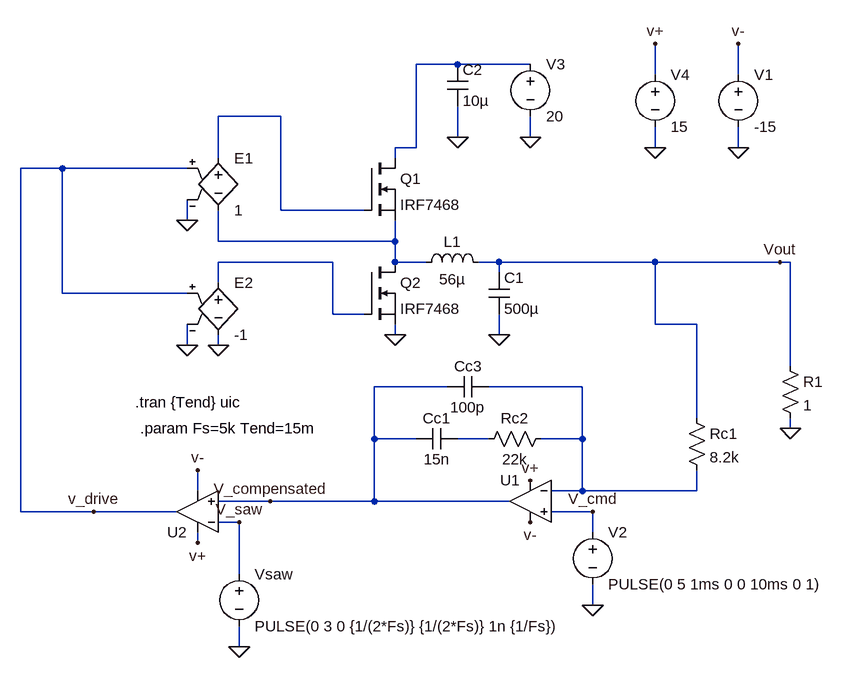
[diagram p0: schematic buck_combined_Type_2.asc]
buck_combined_Type_2.asc, the LTspice schematic file:
Version 4
SHEET 1 1764 1252
WIRE 432 -48 368 -48
WIRE 544 -48 432 -48
WIRE 736 -32 736 -80
WIRE 864 -32 864 -80
WIRE 160 32 64 32
WIRE 432 64 432 16
WIRE 544 64 544 32
WIRE 368 80 368 -48
WIRE 368 80 336 80
WIRE 736 80 736 48
WIRE 864 80 864 48
WIRE 64 96 64 32
WIRE 336 96 336 80
WIRE -176 112 -240 112
WIRE 16 112 -176 112
WIRE 160 176 160 32
WIRE 288 176 160 176
WIRE 16 192 16 160
WIRE 64 224 64 176
WIRE 336 224 336 192
WIRE 336 224 64 224
WIRE 240 256 64 256
WIRE 336 256 336 224
WIRE 384 256 336 256
WIRE 496 256 464 256
WIRE 736 256 496 256
WIRE 928 256 736 256
WIRE 944 256 928 256
WIRE 496 272 496 256
WIRE 64 288 64 256
WIRE -176 304 -176 112
WIRE 16 304 -176 304
WIRE 240 336 240 256
WIRE 288 336 240 336
WIRE 736 352 736 256
WIRE 800 352 736 352
WIRE 336 368 336 352
WIRE 496 368 496 336
WIRE 16 384 16 352
WIRE 64 384 64 368
WIRE 944 416 944 256
WIRE 416 448 304 448
WIRE 624 448 480 448
WIRE 800 496 800 352
WIRE 944 512 944 496
WIRE 304 528 304 448
WIRE 368 528 304 528
WIRE 480 528 432 528
WIRE 624 528 624 448
WIRE 624 528 560 528
WIRE 32 608 32 576
WIRE 624 608 624 528
WIRE 624 608 576 608
WIRE 800 608 800 576
WIRE 800 608 624 608
WIRE 144 624 64 624
WIRE 304 624 304 528
WIRE 304 624 144 624
WIRE 512 624 304 624
WIRE -240 640 -240 112
WIRE -128 640 -240 640
WIRE 0 640 -128 640
WIRE 640 640 576 640
WIRE 96 656 64 656
WIRE 640 672 640 640
WIRE 32 688 32 672
WIRE 96 736 96 656
WIRE 640 784 640 752
WIRE 96 848 96 816
FLAG 336 368 0
FLAG 544 64 0
FLAG 496 368 0
FLAG 944 512 0
FLAG 640 784 0
FLAG 96 848 0
FLAG 544 592 v+
FLAG 928 256 Vout
FLAG 144 624 V_compensated
FLAG 96 656 V_saw
FLAG 16 192 0
FLAG 16 384 0
FLAG 64 384 0
FLAG 432 64 0
FLAG 736 80 0
FLAG 864 80 0
FLAG 736 -80 v+
FLAG 864 -80 v-
FLAG 544 656 v-
FLAG 32 576 v-
FLAG 32 688 v+
FLAG -128 640 v_drive
FLAG 640 640 V_cmd
SYMBOL nmos 288 96 R0
SYMATTR InstName Q1
SYMATTR Value IRF7468
SYMBOL nmos 288 256 R0
SYMATTR InstName Q2
SYMATTR Value IRF7468
SYMBOL voltage 544 -64 R0
WINDOW 123 0 0 Left 0
WINDOW 39 0 0 Left 0
SYMATTR InstName V3
SYMATTR Value 20
SYMBOL ind 368 272 R270
WINDOW 0 32 56 VTop 2
WINDOW 3 5 56 VBottom 2
SYMATTR InstName L1
SYMATTR Value 56µ
SYMBOL cap 480 272 R0
SYMATTR InstName C1
SYMATTR Value 500µ
SYMBOL res 928 400 R0
SYMATTR InstName R1
SYMATTR Value 1
SYMBOL res 784 480 R0
SYMATTR InstName Rc1
SYMATTR Value 8.2k
SYMBOL voltage 640 656 R0
WINDOW 123 0 0 Left 0
WINDOW 39 0 0 Left 0
SYMATTR InstName V2
SYMATTR Value PULSE(0 5 1ms 0 0 10ms 0 1)
SYMBOL res 576 512 R90
WINDOW 0 0 56 VBottom 2
WINDOW 3 32 56 VTop 2
SYMATTR InstName Rc2
SYMATTR Value 22k
SYMBOL cap 432 512 R90
WINDOW 0 0 32 VBottom 2
WINDOW 3 32 32 VTop 2
SYMATTR InstName Cc1
SYMATTR Value 15n
SYMBOL cap 480 432 R90
WINDOW 0 0 32 VBottom 2
WINDOW 3 32 32 VTop 2
SYMATTR InstName Cc3
SYMATTR Value 100p
SYMBOL voltage 96 720 R0
SYMATTR InstName Vsaw
SYMATTR Value PULSE(0 3 0 {1/(2*Fs)} {1/(2*Fs)} 1n {1/Fs})
SYMBOL e 64 80 R0
SYMATTR InstName E1
SYMATTR Value 1
SYMBOL e 64 272 R0
SYMATTR InstName E2
SYMATTR Value -1
SYMBOL cap 416 -48 R0
SYMATTR InstName C2
SYMATTR Value 10µ
SYMBOL voltage 864 -48 R0
WINDOW 123 0 0 Left 0
WINDOW 39 0 0 Left 0
SYMATTR InstName V1
SYMATTR Value -15
SYMBOL voltage 736 -48 R0
WINDOW 123 0 0 Left 0
WINDOW 39 0 0 Left 0
SYMATTR InstName V4
SYMATTR Value 15
SYMBOL OpAmps\\UniversalOpAmp2 544 624 M0
SYMATTR InstName U1
SYMBOL OpAmps\\UniversalOpAmp2 32 640 R180
SYMATTR InstName U2
TEXT -64 472 Left 2 !.tran {Tend} uic
TEXT -56 512 Left 2 !.param Fs=5k Tend=15m

The netlist it stands for:
* buck_combined_Type_2.asc
M§Q1 N001 N002 N003 N003 IRF7468
M§Q2 N003 N004 0 0 IRF7468
V3 N001 0 20
L1 N003 Vout 56µ
C1 Vout 0 500µ
R1 Vout 0 1
Rc1 Vout N005 8.2k
V2 V_cmd 0 PULSE(0 5 1ms 0 0 10ms 0 1)
Rc2 N005 N006 22k
Cc1 N006 V_compensated 15n
Cc3 N005 V_compensated 100p
Vsaw V_saw 0 PULSE(0 3 0 {1/(2*Fs)} {1/(2*Fs)} 1n {1/Fs})
E1 N002 N003 v_drive 0 1
E2 N004 0 v_drive 0 -1
C2 N001 0 10µ
V1 v- 0 -15
V4 v+ 0 15
XU1 V_cmd N005 v+ v- V_compensated level2 Avol=1Meg GBW=10Meg Slew=10Meg Ilimit=25m Rail=0 Vos=0 En=0 Enk=0 In=0 Ink=0 Rin=500Meg  ; pins In+ In- V+ V- OUT
XU2 V_compensated V_saw v+ v- v_drive level2 Avol=1Meg GBW=10Meg Slew=10Meg Ilimit=25m Rail=0 Vos=0 En=0 Enk=0 In=0 Ink=0 Rin=500Meg  ; pins In+ In- V+ V- OUT
.model NMOS NMOS
.model PMOS PMOS
.lib standard.mos
.tran {Tend} uic
.param Fs=5k Tend=15m
.lib UniversalOpAmp2.lib
.backanno
.end